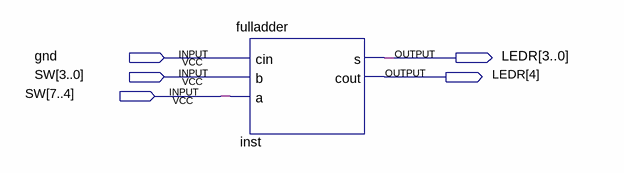
[diagram p0: schematic sheet]
// Quartus schematic AdderDemo.bdf as structural Verilog: 1 symbols, 5 pins
module AdderDemo (
  input  gnd,
  input  [7:0] SW,
  output [4:0] LEDR
);

  wire inst_s, undriven;

  fulladder inst (.cin(gnd), .b(SW[3:0]), .a(undriven), .s(inst_s), .cout(LEDR[4]));
endmodule
